# Altium project novena_evt1.PrjPcb (part 3 of 4)

## Sheet 12mPCIe.SchDoc
size B
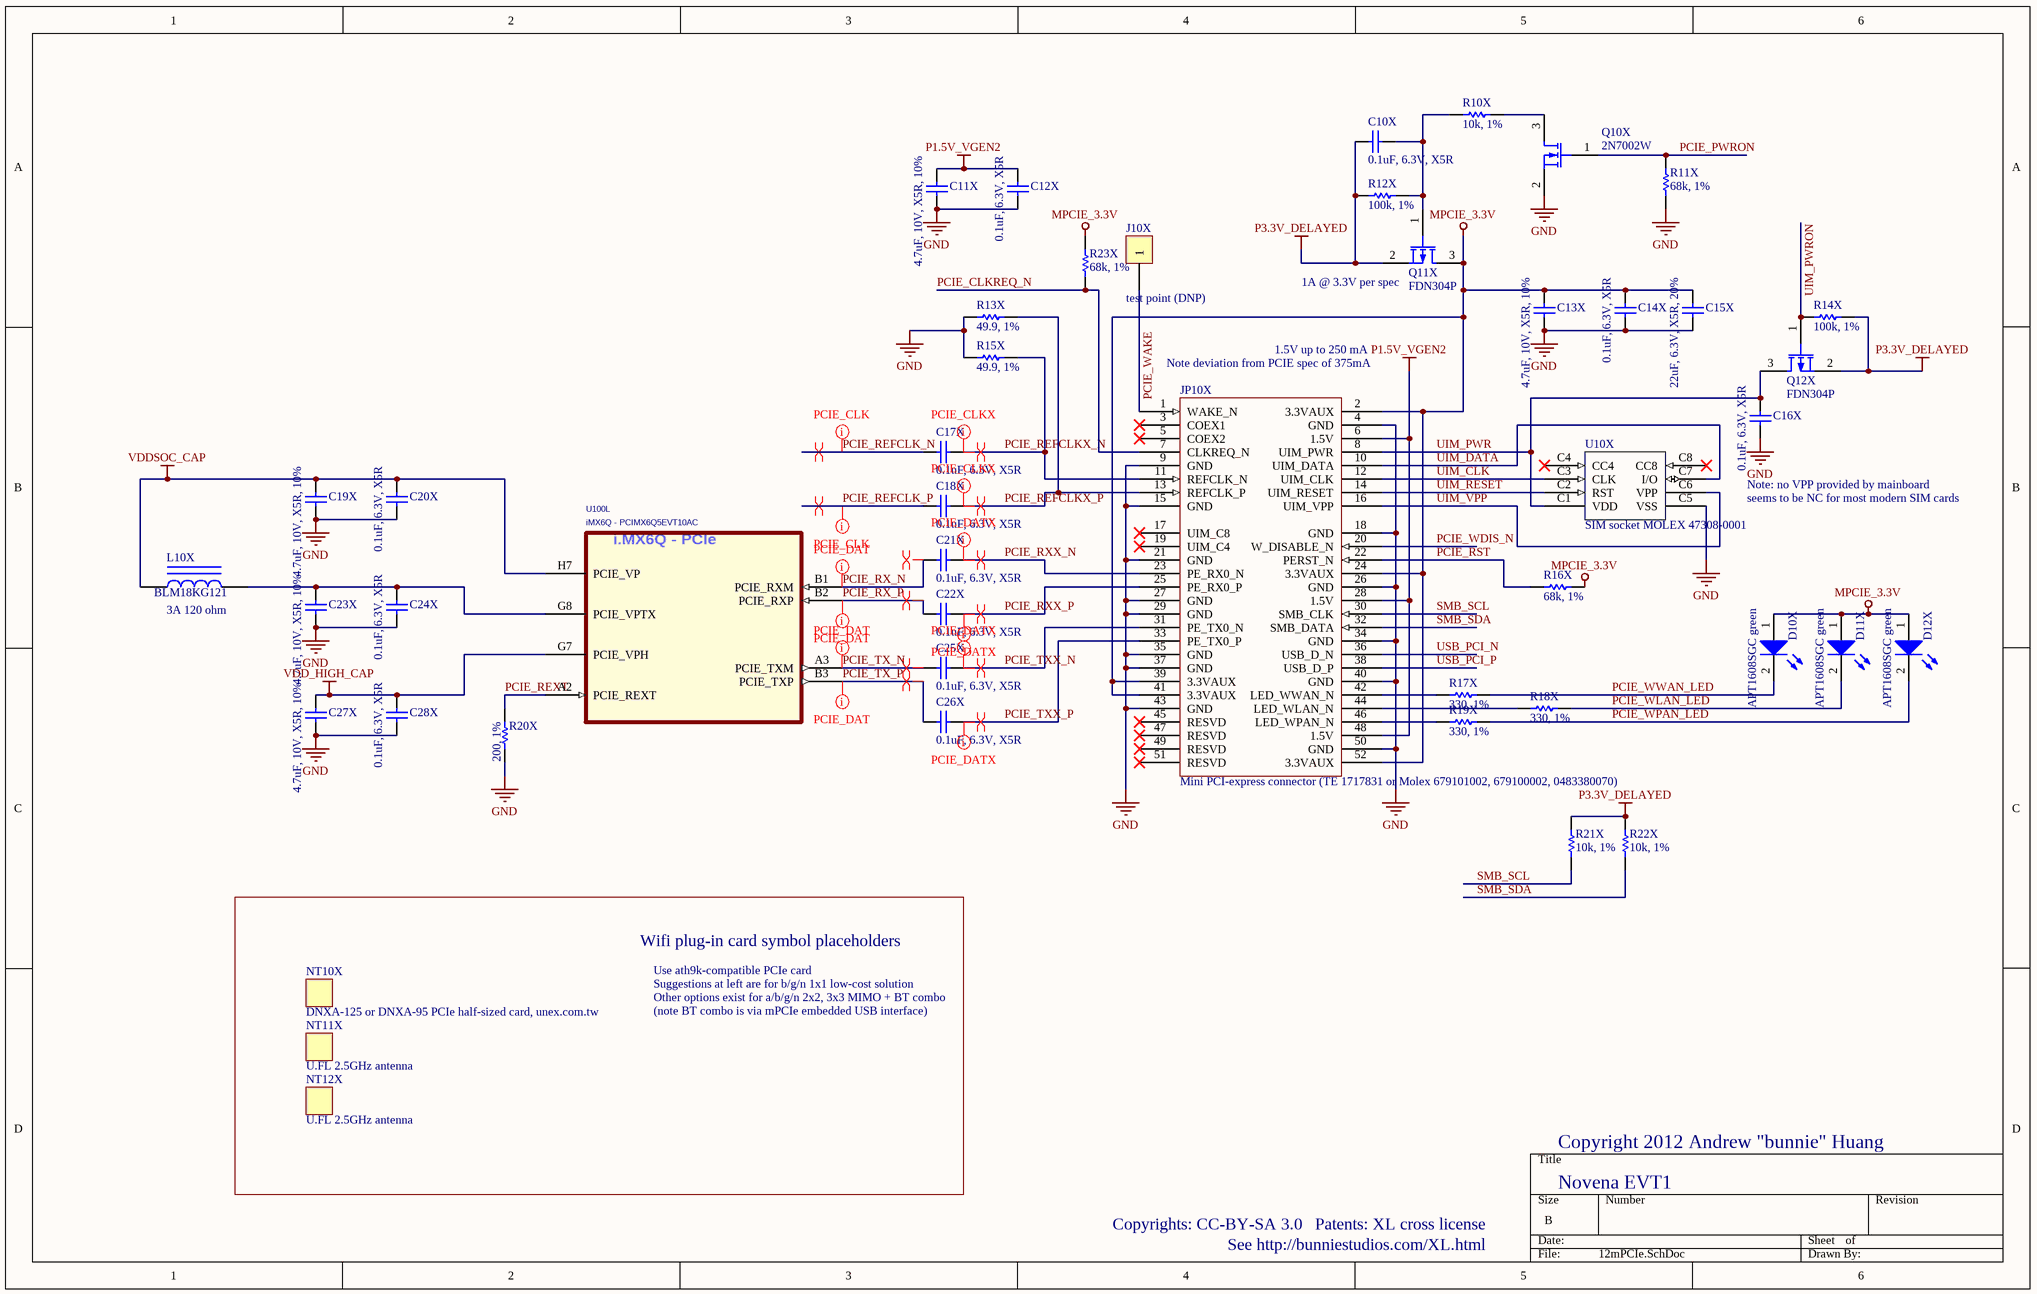
[diagram p12: 12mPCIe.SchDoc]

### Parts
C10X  0.1uF, 6.3V, X5R  [CAPC0603N_B]
C11X  4.7uF, 10V, X5R, 10%  [CAPC1608N]
C12X  0.1uF, 6.3V, X5R  [CAPC0603N_B]
C13X  4.7uF, 10V, X5R, 10%  [CAPC1608N]
C14X  0.1uF, 6.3V, X5R  [CAPC0603N_B]
C15X  22uF, 6.3V, X5R, 20%  [CAPC1608N_HD]
C16X  0.1uF, 6.3V, X5R  [CAPC0603N_B]
C17X  0.1uF, 6.3V, X5R  [CAPC0603N_B]
C18X  0.1uF, 6.3V, X5R  [CAPC0603N_B]
C19X  4.7uF, 10V, X5R, 10%  [CAPC1608N_HD]
C20X  0.1uF, 6.3V, X5R  [CAPC0603N_B]
C21X  0.1uF, 6.3V, X5R  [CAPC0603N_B]
C22X  0.1uF, 6.3V, X5R  [CAPC0603N_B]
C23X  4.7uF, 10V, X5R, 10%  [CAPC1608N_HD]
C24X  0.1uF, 6.3V, X5R  [CAPC0603N_B]
C25X  0.1uF, 6.3V, X5R  [CAPC0603N_B]
C26X  0.1uF, 6.3V, X5R  [CAPC0603N_B]
C27X  4.7uF, 10V, X5R, 10%  [CAPC1608N_HD]
C28X  0.1uF, 6.3V, X5R  [CAPC0603N_B]
D10X  APT1608SGC green  [CD1608-0603]
D11X  APT1608SGC green  [CD1608-0603]
D12X  APT1608SGC green  [CD1608-0603]
J10X  test point (DNP)  [TP_SMT_38mil]
JP10X  Mini PCI-express connector (TE 1717831 or Molex 679101002, 679100002, 0483380070)  [MPCI_FULL_TE_1717831]
L10X  BLM18KG121  value 3A 120 ohm  [INDC1608AN]
NT10X  DNXA-125 or DNXA-95 PCIe half-sized card, unex.com.tw
NT11X  U.FL 2.5GHz antenna
NT12X  U.FL 2.5GHz antenna
Q10X  2N7002W  [SOT323-3AN]
Q11X  FDN304P  [SOT23-3N]
Q12X  FDN304P  [SOT23-3N]
R10X  10k, 1%  [RESC1005N]
R11X  68k, 1%  [RESC1005N]
R12X  100k, 1%  [RESC1005N]
R13X  49.9, 1%  [RESC1005N]
R14X  100k, 1%  [RESC1005N]
R15X  49.9, 1%  [RESC1005N]
R16X  68k, 1%  [RESC1005N]
R17X  330, 1%  [RESC1005N]
R18X  330, 1%  [RESC1005N]
R19X  330, 1%  [RESC1005N]
R20X  200, 1%  [RESC1005N]
R21X  10k, 1%  [RESC1005N]
R22X  10k, 1%  [RESC1005N]
R23X  68k, 1%  [RESC1005N]
U10X  SIM socket MOLEX 47308-0001  [MOLEX_SIM_47308-001]
U100  iMX6Q - PCIMX6Q5EVT10AC  [FREESCALE_BGA624C80P25X25_2100X2100X216]  (part L of 12)

### Blocks framed on the sheet
Wifi plug-in card symbol placeholders: NT10X NT11X NT12X

### Nets
GND: C11X.2 C12X.2 C13X.2 C14X.2 C15X.2 C16X.2 C19X.2 C20X.2 C23X.2 C24X.2 C27X.2 C28X.2 JP10X.4(GND) JP10X.9(GND) JP10X.15(GND) JP10X.18(GND) JP10X.21(GND) JP10X.26(GND) JP10X.27(GND) JP10X.29(GND) JP10X.34(GND) JP10X.35(GND) JP10X.37(GND) JP10X.40(GND) JP10X.43(GND) JP10X.50(GND) Q10X.2(S) R11X.2 R13X.2 R15X.2 R20X.1 U10X.C5(VSS)
MPCIE_3.3V: C13X.1 C14X.1 C15X.1 D10X.1(A) D11X.1(A) D12X.1(A) JP10X.2(3.3VAUX) JP10X.24(3.3VAUX) JP10X.39(3.3VAUX) JP10X.41(3.3VAUX) JP10X.52(3.3VAUX) Q11X.3(D) R16X.1 R23X.2
P1.5V_VGEN2: C11X.1 C12X.1 JP10X.6(1.5V) JP10X.28(1.5V) JP10X.48(1.5V)
P3.3V_DELAYED: C10X.2 Q11X.2(S) Q12X.2(S) R12X.2 R14X.1 R21X.2 R22X.2
VDD_HIGH_CAP: C27X.1 C28X.1 U100.G7(PCIE_VPH)
VDDSOC_CAP: C19X.1 C20X.1 L10X.1 U100.H7(PCIE_VP)
PCIE_CLKREQ_N: JP10X.7(CLKREQ_N) R23X.1
PCIE_PWRON: Q10X.1(G) R11X.1
PCIE_REFCLK_N: C17X.2
PCIE_REFCLK_P: C18X.2
PCIE_REFCLKX_N: C17X.1 JP10X.11(REFCLK_N) R15X.1
PCIE_REFCLKX_P: C18X.1 JP10X.13(REFCLK_P) R13X.1
PCIE_REXT: R20X.2 U100.A2(PCIE_REXT)
PCIE_RST: JP10X.22(PERST_N) R16X.2
PCIE_RX_N: C21X.2 U100.B1(PCIE_RXM)
PCIE_RX_P: C22X.2 U100.B2(PCIE_RXP)
PCIE_RXX_N: C21X.1 JP10X.23(PE_RX0_N)
PCIE_RXX_P: C22X.1 JP10X.25(PE_RX0_P)
PCIE_TX_N: C25X.2 U100.A3(PCIE_TXM)
PCIE_TX_P: C26X.2 U100.B3(PCIE_TXP)
PCIE_TXX_N: C25X.1 JP10X.31(PE_TX0_N)
PCIE_TXX_P: C26X.1 JP10X.33(PE_TX0_P)
PCIE_WAKE: J10X.1 JP10X.1(WAKE_N)
PCIE_WDIS_N: JP10X.20(W_DISABLE_N)
PCIE_WLAN_LED: D11X.2(K) R18X.2
PCIE_WPAN_LED: D12X.2(K) R19X.2
PCIE_WWAN_LED: D10X.2(K) R17X.2
SMB_SCL: JP10X.30(SMB_CLK) R21X.1
SMB_SDA: JP10X.32(SMB_DATA) R22X.1
UIM_CLK: JP10X.12(UIM_CLK) U10X.C3(CLK)
UIM_DATA: JP10X.10(UIM_DATA) U10X.C7(I/O)
UIM_PWR: C16X.1 JP10X.8(UIM_PWR) Q12X.3(D) U10X.C1(VDD)
UIM_PWRON: Q12X.1(G) R14X.2
UIM_RESET: JP10X.14(UIM_RESET) U10X.C2(RST)
UIM_VPP: JP10X.16(UIM_VPP) U10X.C6(VPP)
USB_PCI_N: JP10X.36(USB_D_N)
USB_PCI_P: JP10X.38(USB_D_P)
NetC10X_1: C10X.1 Q11X.1(G) R10X.1 R12X.1
NetC23X_1: C23X.1 C24X.1 L10X.2 U100.G8(PCIE_VPTX)
NetJP10X_42: JP10X.42(LED_WWAN_N) R17X.1
NetJP10X_44: JP10X.44(LED_WLAN_N) R18X.1
NetJP10X_46: JP10X.46(LED_WPAN_N) R19X.1
NetQ10X_3: Q10X.3(D) R10X.2

Not connected (* = marked no-connect by the designer): JP10X 3(COEX1)* 5(COEX2)* 17(UIM_C8)* 19(UIM_C4)* 45(RESVD)* 47(RESVD)* 49(RESVD)* 51(RESVD)*; U10X C4(CC4)* C8(CC8)*

### Layout directives
differential pair: PCIE_REFCLK_N, PCIE_REFCLK_P, PCIE_REFCLKX_N, PCIE_REFCLKX_P, PCIE_RX_N, PCIE_RX_P, PCIE_RXX_N, PCIE_RXX_P, PCIE_TX_N, PCIE_TX_P, PCIE_TXX_N, PCIE_TXX_P
net class PCIE_CLK: PCIE_REFCLK_N, PCIE_REFCLK_P
net class PCIE_DAT: PCIE_RX_N, PCIE_RX_P, PCIE_TX_N, PCIE_TX_P
net class PCIE_DATX: PCIE_RXX_N, PCIE_RXX_P, PCIE_TXX_N, PCIE_TXX_P
net class PCIE_CLKX: PCIE_REFCLKX_N, PCIE_REFCLKX_P

### Notes on the sheet
- (near Q11X) 1A @ 3.3V per spec
- (near JP10X) Note deviation from PCIE spec of 375mA
- 1.5V up to 250 mA
- Note: no VPP provided by mainboard
- seems to be NC for most modern SIM cards
- Use ath9k-compatible PCIe card
- Suggestions at left are for b/g/n 1x1 low-cost solution
- Other options exist for a/b/g/n 2x2, 3x3 MIMO + BT combo
- (note BT combo is via mPCIe embedded USB interface)
- Copyright 2012 Andrew "bunnie" Huang
- Copyrights: CC-BY-SA 3.0
- Patents: XL cross license
- Novena EVT1
- See http://bunniestudios.com/XL.html
- (in symbol PCIMX6Q6VV1A, part L) i.MX6Q - PCIe

### Library data of the parts
C10X C11X C12X C13X C14X C15X C16X C17X C18X C19X C20X C21X C22X C23X C24X C25X C26X C27X C28X = Cap Semi: Capacitor (Semiconductor SIM Model); Published: 8-Jun-2000; LatestRevisionDate: 17-Jul-2002; LatestRevisionNote: Re-released for DXP Platform.; PackageReference: C1206; Publisher: Altium Limited
D10X D11X D12X = LED2: Typical RED, GREEN, YELLOW, AMBER GaAs LED; Published: 8-Jun-2000; LatestRevisionDate: 17-Jul-2002; LatestRevisionNote: Re-released for DXP Platform.; PackageVersion: Feb-2002; PackageReference: 3.2X1.6X1.1; Publisher: Altium Limited
J10X = CON1: Connector
JP10X = MINI_PCIE: Mini PCI-express, e.g. TE 1717831
L10X = Inductor Iron: Magnetic-Core Inductor; Published: 24-Mar-1999; LatestRevisionDate: 17-Jul-2002; LatestRevisionNote: Re-released for DXP Platform.; PackageReference: AXIAL-0.9; Publisher: Altium Limited
NT10X NT11X NT12X = NOTE: Placeholder for non-electrical BOM items
Q10X = MOSFET-N: N-Channel MOSFET; Published: 8-Jun-2000; LatestRevisionDate: 17-Jul-2002; LatestRevisionNote: Re-released for DXP Platform.; PackageVersion: 1995/1996; PackageReference: E3; Publisher: Altium Limited
Q11X Q12X = MOSFET-P: P-Channel MOSFET; Published: 8-Jun-2000; LatestRevisionDate: 17-Jul-2002; LatestRevisionNote: Re-released for DXP Platform.; PackageVersion: 1995/1996; PackageReference: E3; Publisher: Altium Limited; PackageDescription: TO, Flat Index; 3 In-Line, Axial Leads; Body Dia. 4.6mm; Lead Dia. 0.5 mm (max)
R10X R11X R13X R15X R16X R17X R18X R19X R20X R21X R22X R23X = Res1: Resistor; Value: 100k; Published: 8-Jun-2000; LatestRevisionDate: 17-Jul-2002; LatestRevisionNote: Re-released for DXP Platform.; PackageReference: AXIAL-0.3; Publisher: Altium Limited
R12X R14X = Res1: Resistor; Published: 8-Jun-2000; LatestRevisionDate: 17-Jul-2002; LatestRevisionNote: Re-released for DXP Platform.; PackageReference: AXIAL-0.3; Publisher: Altium Limited; Value: 100k
U10X = ISO7816 (SIM card): ISO 7816 SIM card socket
U100 = PCIMX6Q6VV1A: as U100 on sheet 06cpu_soc; MFG_PN01: PCIMX6Q6VV1A; ROHS: Yes; HEIGHT: 2.16MM

## Sheet 13hdmi_lcd.SchDoc
size C
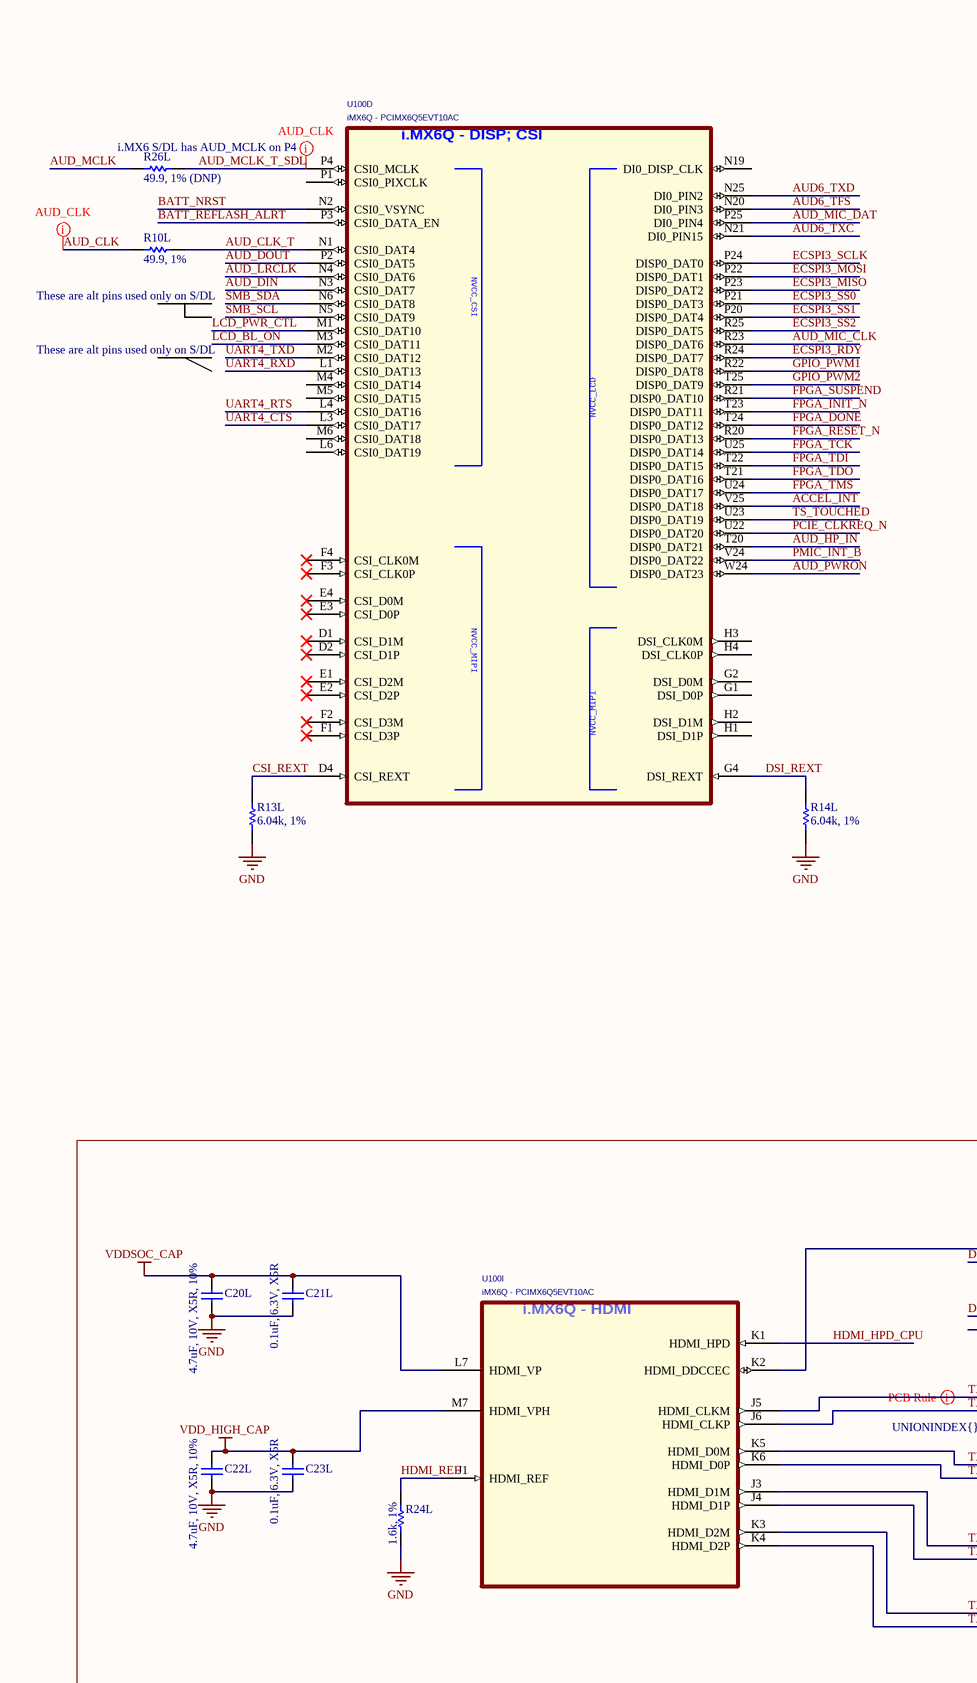
[diagram p13: 13hdmi_lcd.SchDoc, left]
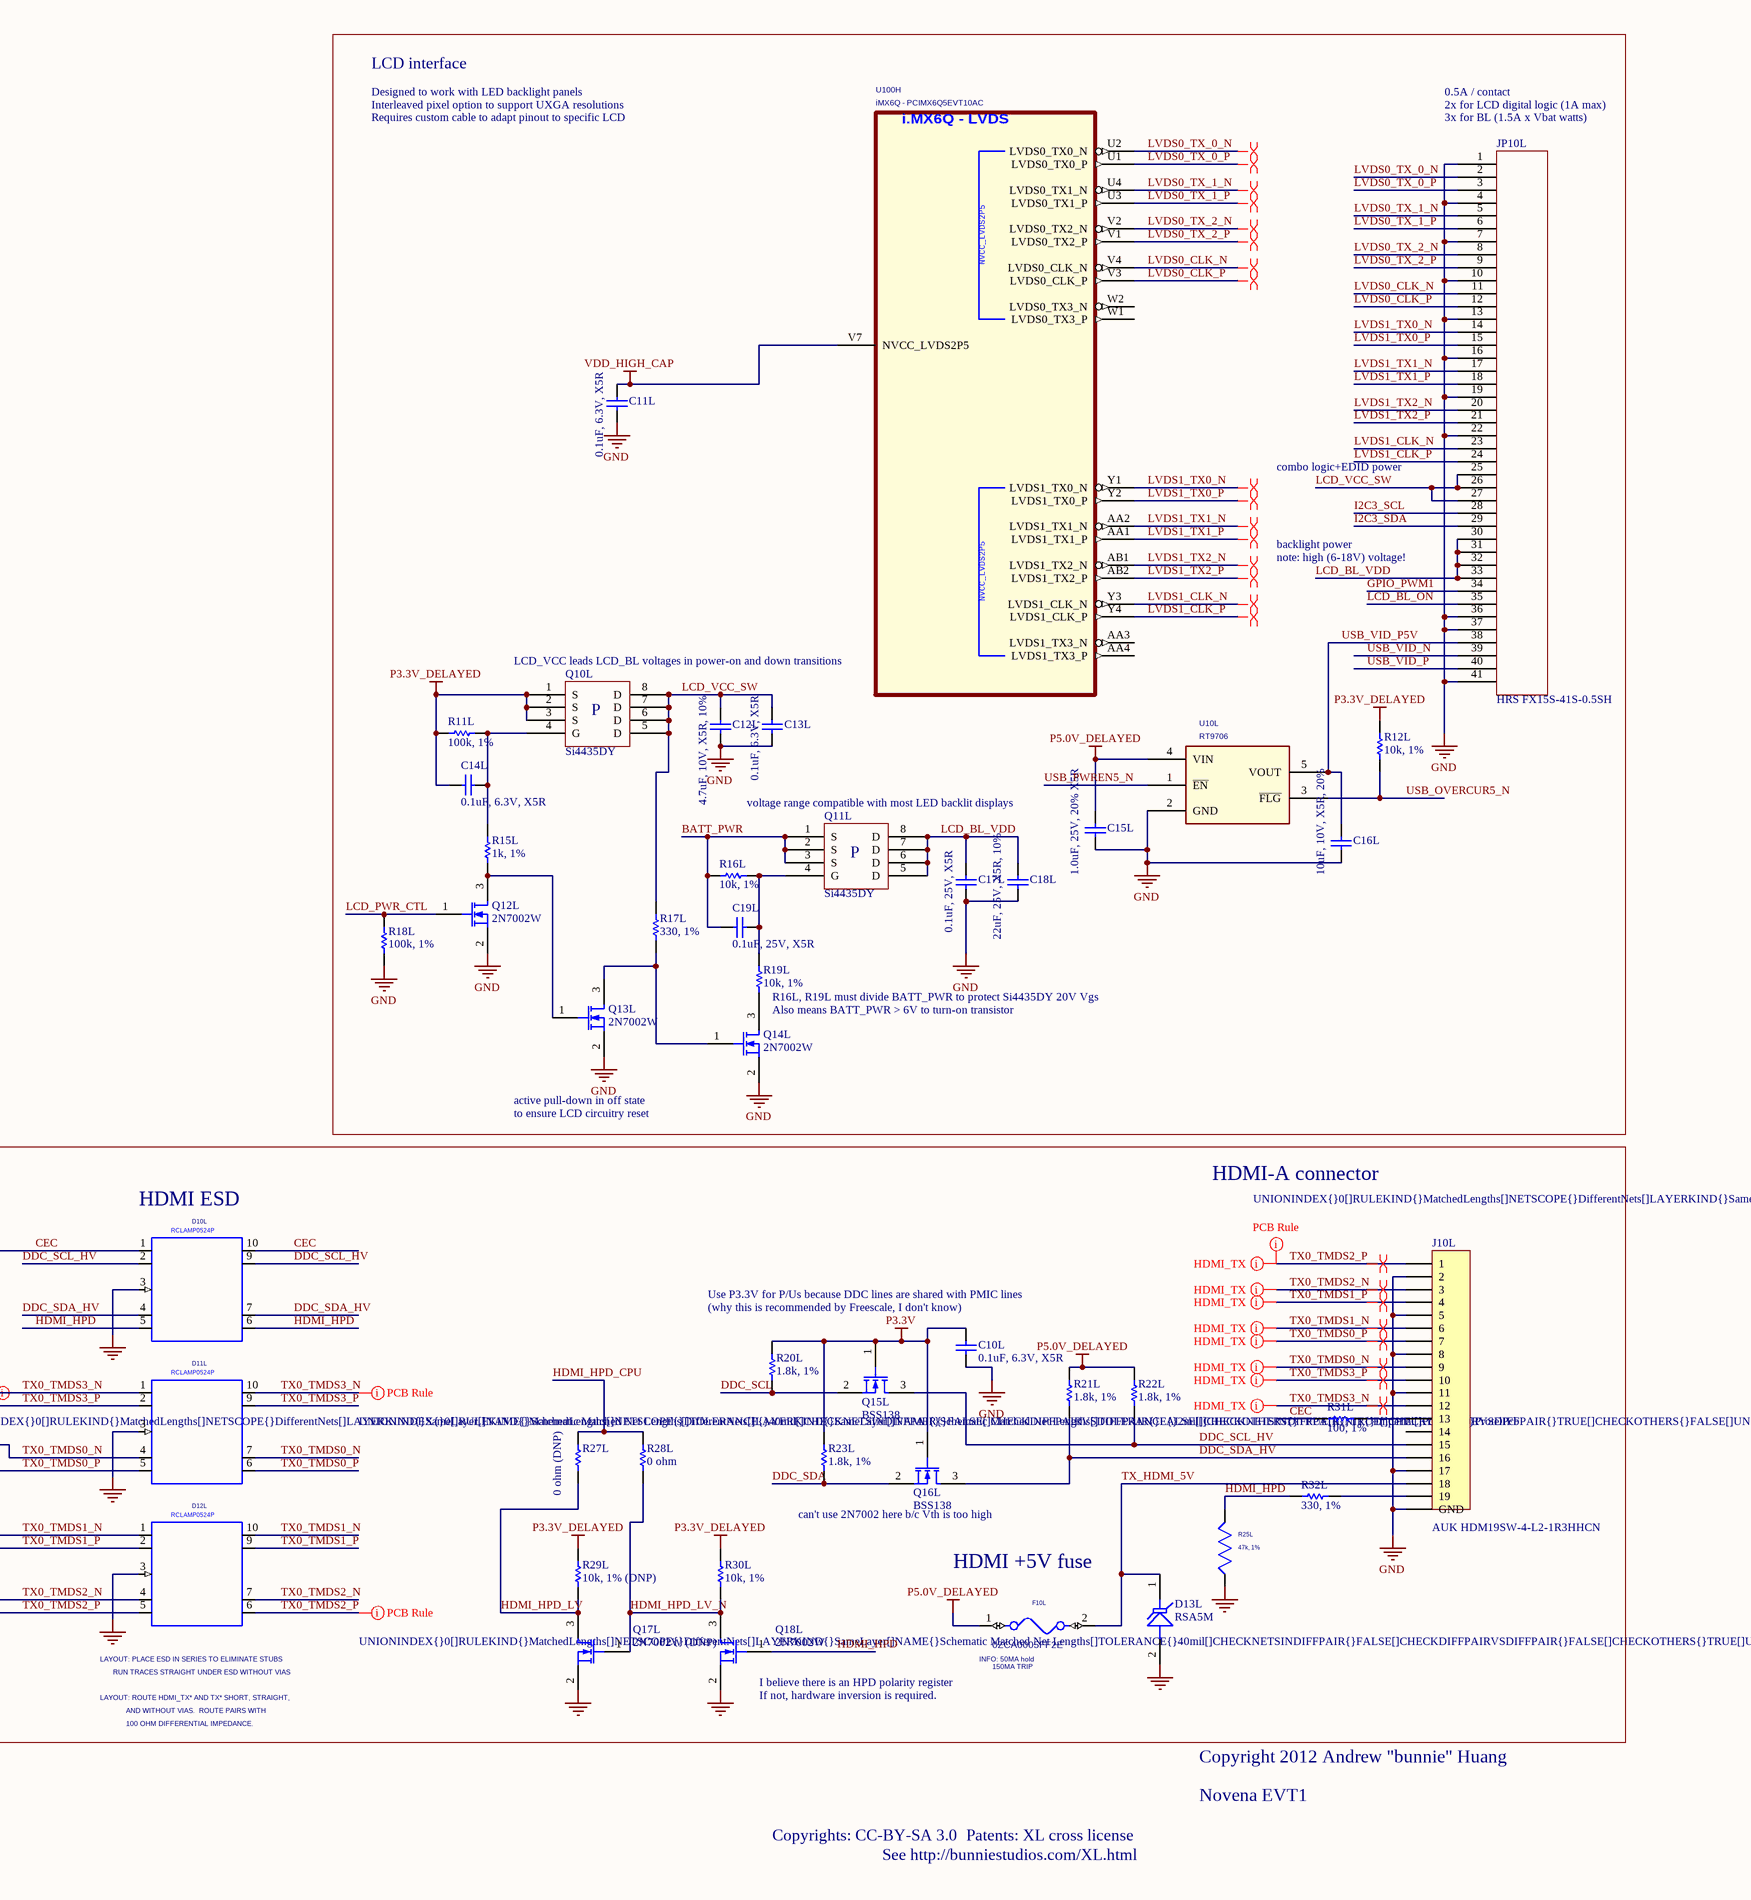
[diagram p14: 13hdmi_lcd.SchDoc, right]

### Parts
C10L  0.1uF, 6.3V, X5R  [CAPC0603N_B]
C11L  0.1uF, 6.3V, X5R  [CAPC0603N_B]
C12L  4.7uF, 10V, X5R, 10%  [CAPC1608N]
C13L  0.1uF, 6.3V, X5R  [CAPC0603N_B]
C14L  0.1uF, 6.3V, X5R  [CAPC0603N_B]
C15L  1.0uF, 25V, 20% X5R  [CAPC1608N]
C16L  10uF, 10V, X5R, 20%  [CAPC1608N]
C17L  0.1uF, 25V, X5R  [CAPC1005N]
C18L  22uF, 25V, X5R, 10%  [CAPC3225N]
C19L  0.1uF, 25V, X5R  [CAPC1005N]
C20L  4.7uF, 10V, X5R, 10%  [CAPC1608N_HD]
C21L  0.1uF, 6.3V, X5R  [CAPC0603N_B]
C22L  4.7uF, 10V, X5R, 10%  [CAPC1608N_HD]
C23L  0.1uF, 6.3V, X5R  [CAPC0603N_B]
D10L  RCLAMP0524P  [SEMTECH_SLP2510P8]  (value not drawn)
D11L  RCLAMP0524P  [SEMTECH_SLP2510P8]  (value not drawn)
D12L  RCLAMP0524P  [SEMTECH_SLP2510P8]  (value not drawn)
D13L  RSA5M  [SOD123/X.85]
F10L  0ZCA0005FF2E  [RESC3216N]
J10L  AUK HDM19SW-4-L2-1R3HHCN  [MOLEX_47151-0001]
JP10L  HRS FX15S-41S-0.5SH  [HRS_FX15S-41S-0.5SH]
Q10L  Si4435DY  [SOIC127P600-8AN]
Q11L  Si4435DY  [SOIC127P600-8AN]
Q12L  2N7002W  [SOT323-3AN]
Q13L  2N7002W  [SOT323-3AN]
Q14L  2N7002W  [SOT323-3AN]
Q15L  BSS138  [SOT23-3N]
Q16L  BSS138  [SOT23-3N]
Q17L  2N7002W (DNP)  [SOT323-3AN]
Q18L  2N7002W  [SOT323-3AN]
R10L  49.9, 1%  [RESC1005N]
R11L  100k, 1%  [RESC1005N]
R12L  10k, 1%  [RESC1005N]
R13L  6.04k, 1%  [RESC1005N]
R14L  6.04k, 1%  [RESC1005N]
R15L  1k, 1%  [RESC1005N]
R16L  10k, 1%  [RESC1005N]
R17L  330, 1%  [RESC1005N]
R18L  100k, 1%  [RESC1005N]
R19L  10k, 1%  [RESC1005N]
R20L  1.8k, 1%  [RESC1005N]
R21L  1.8k, 1%  [RESC1005N]
R22L  1.8k, 1%  [RESC1005N]
R23L  1.8k, 1%  [RESC1005N]
R24L  1.6k, 1%  [RESC1005N]
R25L  47k, 1%  [RESC1005N]
R26L  49.9, 1% (DNP)  [RESC1005N]
R27L  0 ohm (DNP)  [RESC1005N]
R28L  0 ohm  [RESC1005N]
R29L  10k, 1% (DNP)  [RESC1005N]
R30L  10k, 1%  [RESC1005N]
R31L  100, 1%  [RESC1005N]
R32L  330, 1%  [RESC1005N]
U10L  RT9706  [SOT23-5AN]
U100  iMX6Q - PCIMX6Q5EVT10AC  [FREESCALE_BGA624C80P25X25_2100X2100X216]  (parts D,H,I of 12)

### Blocks framed on the sheet
LCD interface: C11L C12L C13L C14L C15L C16L C17L C18L C19L JP10L Q10L Q11L Q12L Q13L Q14L R11L R12L R15L R16L R17L R18L R19L U10L U100

### Nets
GND: C10L.2 C11L.2 C12L.2 C13L.2 C15L.2 C16L.2 C17L.2 C18L.2 C20L.2 C21L.2 C22L.2 C23L.2 D10L.3(GND1) D11L.3(GND1) D12L.3(GND1) D13L.2(A) J10L.0(GND) J10L.2 J10L.5 J10L.8 J10L.11 J10L.17 JP10L.1 JP10L.4 JP10L.7 JP10L.10 JP10L.13 JP10L.16 JP10L.19 JP10L.22 JP10L.36 JP10L.37 JP10L.41 Q12L.2(S) Q13L.2(S) Q14L.2(S) Q17L.2(S) Q18L.2(S) R13L.2 R14L.2 R18L.1 R24L.1 R25L.2(B) U10L.2(GND)
P3.3V: C10L.1 Q15L.1(G) Q16L.1(G) R20L.1 R23L.1
P3.3V_DELAYED: C14L.1 Q10L.1(S) Q10L.2(S) Q10L.3(S) R11L.2 R12L.2 R29L.1 R30L.1
P5.0V_DELAYED: C15L.1 F10L.1 R21L.1 R22L.1 U10L.4(VIN)
VDD_HIGH_CAP: C11L.1 C22L.1 C23L.1 U100.M7(HDMI_VPH) U100.V7(NVCC_LVDS2P5)
VDDSOC_CAP: C20L.1 C21L.1 U100.L7(HDMI_VP)
ACCEL_INT: U100.V25(DISP0_DAT18)
AUD6_TFS: U100.N20(DI0_PIN3)
AUD6_TXC: U100.N21(DI0_PIN15)
AUD6_TXD: U100.N25(DI0_PIN2)
AUD_CLK: R10L.2
AUD_CLK_T: R10L.1 U100.N1(CSI0_DAT4)
AUD_DIN: U100.N3(CSI0_DAT7)
AUD_DOUT: U100.P2(CSI0_DAT5)
AUD_HP_IN: U100.T20(DISP0_DAT21)
AUD_LRCLK: U100.N4(CSI0_DAT6)
AUD_MCLK: R26L.2
AUD_MCLK_T_SDL: R26L.1 U100.P4(CSI0_MCLK)
AUD_MIC_CLK: U100.R23(DISP0_DAT6)
AUD_MIC_DAT: U100.P25(DI0_PIN4)
AUD_PWRON: U100.W24(DISP0_DAT23)
BATT_NRST: U100.N2(CSI0_VSYNC)
BATT_PWR: C19L.1 Q11L.1(S) Q11L.2(S) Q11L.3(S) R16L.2
BATT_REFLASH_ALRT: U100.P3(CSI0_DATA_EN)
CEC: D10L.1(IO1A) D10L.10(IO1B) R31L.2 U100.K2(HDMI_DDCCEC)
CSI_REXT: R13L.1 U100.D4(CSI_REXT)
DDC_SCL: Q15L.2(S) R20L.2
DDC_SCL_HV: D10L.2(IO2A) D10L.9(IO2B) J10L.15 Q15L.3(D) R22L.2
DDC_SDA: Q16L.2(S) R23L.2
DDC_SDA_HV: D10L.4(IO3A) D10L.7(IO3B) J10L.16 Q16L.3(D) R21L.2
DSI_REXT: R14L.1 U100.G4(DSI_REXT)
ECSPI3_MISO: U100.P23(DISP0_DAT2)
ECSPI3_MOSI: U100.P22(DISP0_DAT1)
ECSPI3_RDY: U100.R24(DISP0_DAT7)
ECSPI3_SCLK: U100.P24(DISP0_DAT0)
ECSPI3_SS0: U100.P21(DISP0_DAT3)
ECSPI3_SS1: U100.P20(DISP0_DAT4)
ECSPI3_SS2: U100.R25(DISP0_DAT5)
FPGA_DONE: U100.T24(DISP0_DAT12)
FPGA_INIT_N: U100.T23(DISP0_DAT11)
FPGA_RESET_N: U100.R20(DISP0_DAT13)
FPGA_SUSPEND: U100.R21(DISP0_DAT10)
FPGA_TCK: U100.U25(DISP0_DAT14)
FPGA_TDI: U100.T22(DISP0_DAT15)
FPGA_TDO: U100.T21(DISP0_DAT16)
FPGA_TMS: U100.U24(DISP0_DAT17)
GPIO_PWM1: JP10L.34 U100.R22(DISP0_DAT8)
GPIO_PWM2: U100.T25(DISP0_DAT9)
HDMI_HPD: D10L.5(IO4A) D10L.6(IO4B) Q18L.1(G) R25L.1(A) R32L.2
HDMI_HPD_CPU: R27L.1 R28L.1 U100.K1(HDMI_HPD)
HDMI_HPD_LV: Q17L.3(D) R27L.2 R29L.2
HDMI_HPD_LV_N: Q17L.1(G) Q18L.3(D) R28L.2 R30L.2
HDMI_REF: R24L.2 U100.J1(HDMI_REF)
I2C3_SCL: JP10L.28
I2C3_SDA: JP10L.29
LCD_BL_ON: JP10L.35 U100.M3(CSI0_DAT11)
LCD_BL_VDD: C17L.1 C18L.1 JP10L.30 JP10L.31 JP10L.32 JP10L.33 Q11L.5(D) Q11L.6(D) Q11L.7(D) Q11L.8(D)
LCD_PWR_CTL: Q12L.1(G) R18L.2 U100.M1(CSI0_DAT10)
LCD_VCC_SW: C12L.1 C13L.1 JP10L.25 JP10L.26 JP10L.27 Q10L.5(D) Q10L.6(D) Q10L.7(D) Q10L.8(D) R17L.2
LVDS0_CLK_N: JP10L.11 U100.V4(LVDS0_CLK_N)
LVDS0_CLK_P: JP10L.12 U100.V3(LVDS0_CLK_P)
LVDS0_TX_0_N: JP10L.2 U100.U2(LVDS0_TX0_N)
LVDS0_TX_0_P: JP10L.3 U100.U1(LVDS0_TX0_P)
LVDS0_TX_1_N: JP10L.5 U100.U4(LVDS0_TX1_N)
LVDS0_TX_1_P: JP10L.6 U100.U3(LVDS0_TX1_P)
LVDS0_TX_2_N: JP10L.8 U100.V2(LVDS0_TX2_N)
LVDS0_TX_2_P: JP10L.9 U100.V1(LVDS0_TX2_P)
LVDS1_CLK_N: JP10L.23 U100.Y3(LVDS1_CLK_N)
LVDS1_CLK_P: JP10L.24 U100.Y4(LVDS1_CLK_P)
LVDS1_TX0_N: JP10L.14 U100.Y1(LVDS1_TX0_N)
LVDS1_TX0_P: JP10L.15 U100.Y2(LVDS1_TX0_P)
LVDS1_TX1_N: JP10L.17 U100.AA2(LVDS1_TX1_N)
LVDS1_TX1_P: JP10L.18 U100.AA1(LVDS1_TX1_P)
LVDS1_TX2_N: JP10L.20 U100.AB1(LVDS1_TX2_N)
LVDS1_TX2_P: JP10L.21 U100.AB2(LVDS1_TX2_P)
PCIE_CLKREQ_N: U100.U22(DISP0_DAT20)
PMIC_INT_B: U100.V24(DISP0_DAT22)
SMB_SCL: U100.N5(CSI0_DAT9)
SMB_SDA: U100.N6(CSI0_DAT8)
TS_TOUCHED: U100.U23(DISP0_DAT19)
TX0_TMDS0_N: D11L.4(IO3A) D11L.7(IO3B) J10L.9 U100.K5(HDMI_D0M)
TX0_TMDS0_P: D11L.5(IO4A) D11L.6(IO4B) J10L.7 U100.K6(HDMI_D0P)
TX0_TMDS1_N: D12L.1(IO1A) D12L.10(IO1B) J10L.6 U100.J3(HDMI_D1M)
TX0_TMDS1_P: D12L.2(IO2A) D12L.9(IO2B) J10L.4 U100.J4(HDMI_D1P)
TX0_TMDS2_N: D12L.4(IO3A) D12L.7(IO3B) J10L.3 U100.K3(HDMI_D2M)
TX0_TMDS2_P: D12L.5(IO4A) D12L.6(IO4B) J10L.1 U100.K4(HDMI_D2P)
TX0_TMDS3_N: D11L.1(IO1A) D11L.10(IO1B) J10L.12 U100.J5(HDMI_CLKM)
TX0_TMDS3_P: D11L.2(IO2A) D11L.9(IO2B) J10L.10 U100.J6(HDMI_CLKP)
TX_HDMI_5V: D13L.1(K) F10L.2 J10L.18
UART4_CTS: U100.L3(CSI0_DAT17)
UART4_RTS: U100.L4(CSI0_DAT16)
UART4_RXD: U100.L1(CSI0_DAT13)
UART4_TXD: U100.M2(CSI0_DAT12)
USB_OVERCUR5_N: R12L.1 U10L.3(~{FLG})
USB_PWREN5_N: U10L.1(~{EN})
USB_VID_N: JP10L.39
USB_VID_P: JP10L.40
USB_VID_P5V: C16L.1 JP10L.38 U10L.5(VOUT)
NetC14L_2: C14L.2 Q10L.4(G) R11L.1 R15L.1
NetC19L_2: C19L.2 Q11L.4(G) R16L.1 R19L.1
NetJ10L_13: J10L.13 R31L.1
NetJ10L_19: J10L.19 R32L.1
NetQ12L_3: Q12L.3(D) Q13L.1(G) R15L.2
NetQ13L_3: Q13L.3(D) Q14L.1(G) R17L.1
NetQ14L_3: Q14L.3(D) R19L.2

Not connected (* = marked no-connect by the designer): J10L 14; U100 AA3(LVDS1_TX3_N) AA4(LVDS1_TX3_P) D1(CSI_D1M)* D2(CSI_D1P)* E1(CSI_D2M)* E2(CSI_D2P)* E3(CSI_D0P)* E4(CSI_D0M)* F1(CSI_D3P)* F2(CSI_D3M)* F3(CSI_CLK0P)* F4(CSI_CLK0M)* G1(DSI_D0P) G2(DSI_D0M) H1(DSI_D1P) H2(DSI_D1M) H3(DSI_CLK0M) H4(DSI_CLK0P) L6(CSI0_DAT19) M4(CSI0_DAT14) M5(CSI0_DAT15) M6(CSI0_DAT18) N19(DI0_DISP_CLK) P1(CSI0_PIXCLK) W1(LVDS0_TX3_P) W2(LVDS0_TX3_N)

### Layout directives
differential pair: LVDS0_CLK_N, LVDS0_CLK_P, LVDS0_TX_0_N, LVDS0_TX_0_P, LVDS0_TX_1_N, LVDS0_TX_1_P, LVDS0_TX_2_N, LVDS0_TX_2_P, LVDS1_CLK_N, LVDS1_CLK_P, LVDS1_TX0_N, LVDS1_TX0_P, LVDS1_TX1_N, LVDS1_TX1_P, LVDS1_TX2_N, LVDS1_TX2_P, TX0_TMDS0_N, TX0_TMDS0_P, TX0_TMDS1_N, TX0_TMDS1_P, TX0_TMDS2_N, TX0_TMDS2_P, TX0_TMDS3_N, TX0_TMDS3_P
net class HDMI_TX: TX0_TMDS0_N, TX0_TMDS0_P, TX0_TMDS1_N, TX0_TMDS1_P, TX0_TMDS2_N, TX0_TMDS2_P, TX0_TMDS3_N, TX0_TMDS3_P
rule Matched Net Lengths [Tolerance = 40mil]: TX0_TMDS2_P, TX0_TMDS3_N
rule Matched Net Lengths [Tolerance = 2mil]: TX0_TMDS2_P, TX0_TMDS3_N
net class AUD_CLK: AUD_CLK, AUD_MCLK_T_SDL

### Notes on the sheet
- Designed to work with LED backlight panels
- Interleaved pixel option to support UXGA resolutions
- Requires custom cable to adapt pinout to specific LCD
- 0.5A / contact
- 2x for LCD digital logic (1A max)
- (near JP10L) 3x for BL (1.5A x Vbat watts)
- (near R26L) i.MX6 S/DL has AUD_MCLK on P4
- (near R10L) These are alt pins used only on S/DL
- These are alt pins used only on S/DL
- combo logic+EDID power
- backlight power
- note: high (6-18V) voltage!
- (near U100) LCD_VCC leads LCD_BL voltages in power-on and down transitions
- voltage range compatible with most LED backlit displays
- (near R19L) R16L, R19L must divide BATT_PWR to protect Si4435DY 20V Vgs
- Also means BATT_PWR > 6V to turn-on transistor
- active pull-down in off state
- to ensure LCD circuitry reset
- (near D10L) HDMI ESD
- HDMI-A connector
- Use P3.3V for P/Us because DDC lines are shared with PMIC lines
- (why this is recommended by Freescale, I don't know)
- can't use 2N7002 here b/c Vth is too high
- HDMI +5V fuse
- (near D12L) LAYOUT: PLACE ESD IN SERIES TO ELIMINATE STUBS
- RUN TRACES STRAIGHT UNDER ESD WITHOUT VIAS
- (near F10L) INFO: 50MA hold
- (near F10L) 150MA TRIP
- LAYOUT: ROUTE HDMI_TX* AND TX* SHORT, STRAIGHT,
- 100 OHM DIFFERENTIAL IMPEDANCE.
- AND WITHOUT VIAS.  ROUTE PAIRS WITH
- (near Q18L) I believe there is an HPD polarity register
- (near Q18L) If not, hardware inversion is required.
- Copyright 2012 Andrew "bunnie" Huang
- Novena EVT1
- Copyrights: CC-BY-SA 3.0
- See http://bunniestudios.com/XL.html
- Patents: XL cross license
- (in symbol PCIMX6Q6VV1A, part D) i.MX6Q - DISP; CSI
- (in symbol PCIMX6Q6VV1A, part H) i.MX6Q - LVDS
- (in symbol PCIMX6Q6VV1A, part I) i.MX6Q - HDMI
- (in symbol Si4435DY) P

### Library data of the parts
C10L C11L C12L C13L C14L C15L C16L C17L C18L C19L C20L C21L C22L C23L = Cap Semi: Capacitor (Semiconductor SIM Model); Published: 8-Jun-2000; LatestRevisionDate: 17-Jul-2002; LatestRevisionNote: Re-released for DXP Platform.; PackageReference: C1206; Publisher: Altium Limited
D10L D11L D12L = RCLAMP0524P: PART_NUMBER: V00004-001; CDS_LMAN_SYM_OUTLINE: -175,225,175,-175; MATERIAL: IC; PACK_TYPE: SLP1610P4; PATH: I24; OriginalSymbolOrigin: (-175,225); LOCATION: D8; XY: (-2475,4175); VER: 1; ROT: 0; PHYS_PAGE: 10; DRAWING: @BROWNSTONE_LIB.BROWNSTONE(SCH_1):PAGE10; CDS_LIB: integrated_circuits; SEC_TYPE: SLP1610P4; SEC: 1; CDS_LOCATION: D8; $LOCATION: D8
D13L = Tranzorb: Published: 24-Mar-1999; LatestRevisionDate: 17-Jul-2002; LatestRevisionNote: Re-released for DXP Platform.; PackageReference: DO-7; Publisher: Altium Limited
F10L = FUSE0805: BelFuse, 50mA hold, 150mA trip; PART_NUMBER: M00014-001; CDS_LMAN_SYM_OUTLINE: -75,50,75,-50; OriginalSymbolOrigin: (-125,50); LOCATION: F1; XY: (-4350,3000); VER: 1; ROT: 0; PHYS_PAGE: 10; PATH: I13; MATERIAL: FUSE; DRAWING: @BROWNSTONE_LIB.BROWNSTONE(SCH_1):PAGE10; CDS_LIB: fuses; SEC_TYPE: FUSE0805; SEC: 1; PACK_TYPE: FUSE0805; CDS_LOCATION: F1; $LOCATION: F1
J10L = Header 19: Molex HDMI connector, Type A; LatestRevisionDate: 17-Jul-2002; LatestRevisionNote: Re-released for DXP Platform.; Publisher: Altium Limited
JP10L = HRS_FX15S-41S-0.5SH: 41-pin header
Q10L Q11L = Si4435DY: Singre P-channel FET, 8A, 30V
Q12L Q13L Q14L Q15L Q16L Q17L Q18L = MOSFET-N: N-Channel MOSFET; Published: 8-Jun-2000; LatestRevisionDate: 17-Jul-2002; LatestRevisionNote: Re-released for DXP Platform.; PackageVersion: 1995/1996; PackageReference: E3; Publisher: Altium Limited
R10L R12L R13L R14L R15L R16L R17L R19L R20L R21L R22L R23L R24L R26L R27L R28L R29L R30L R31L R32L = Res1: Resistor; Value: 100k; Published: 8-Jun-2000; LatestRevisionDate: 17-Jul-2002; LatestRevisionNote: Re-released for DXP Platform.; PackageReference: AXIAL-0.3; Publisher: Altium Limited
R11L R18L = Res1: Resistor; Published: 8-Jun-2000; LatestRevisionDate: 17-Jul-2002; LatestRevisionNote: Re-released for DXP Platform.; PackageReference: AXIAL-0.3; Publisher: Altium Limited; Value: 100k
R25L = RES#1: PART_NUMBER: D13015-001; NEEDS_NO_SIZE: TRUE; PACK_TYPE: RES0402; PATH: I12; WATTAGE: 1/16W; OriginalSymbolOrigin: (-50,100); LOCATION: R125; SEC: 1; XY: (-1400,3050); VER: 2; ROT: 0; PHYS_PAGE: 10; MFG_PN: ERJ-2RKF1002X; MFG: PANASONIC; DRAWING: @BROWNSTONE_LIB.BROWNSTONE(SCH_1):PAGE10; CDS_LIB: resistors; MATERIAL: CH; TOL: 1%; TOLERENCE: ?; CDS_SEC: 1; CDS_LOCATION: R125; $TOLERENCE: ?; $SEC: 1; $LOCATION: R125
U10L = RT9706: IC LIN SW W/FLAG 500MA 2.0-5.5V SOT23-5; AGILE_PN: 315-77830; MFG_NAME01: RICHTEK; MFG_PN01: RT9706PB; CAD_APPROVED: Yes; ROHS: Yes; HEIGHT: 1.295MM
U100 = PCIMX6Q6VV1A: PCIMX6Q5EVT10AC; AGILE_PN: TMP-WF-14526; DESCRIPTION: PLACEHOLDER FOR FREESCALE PART NUMBER PMCIMX6Q6VV1A.; MFG_NAME01: Freescale Semiconductor; PRE_APN: 344-01218; MFG_PN01: PCIMX6Q6VV1A; ROHS: Yes; HEIGHT: 2.16MM

## Sheet 14audio.SchDoc
size B
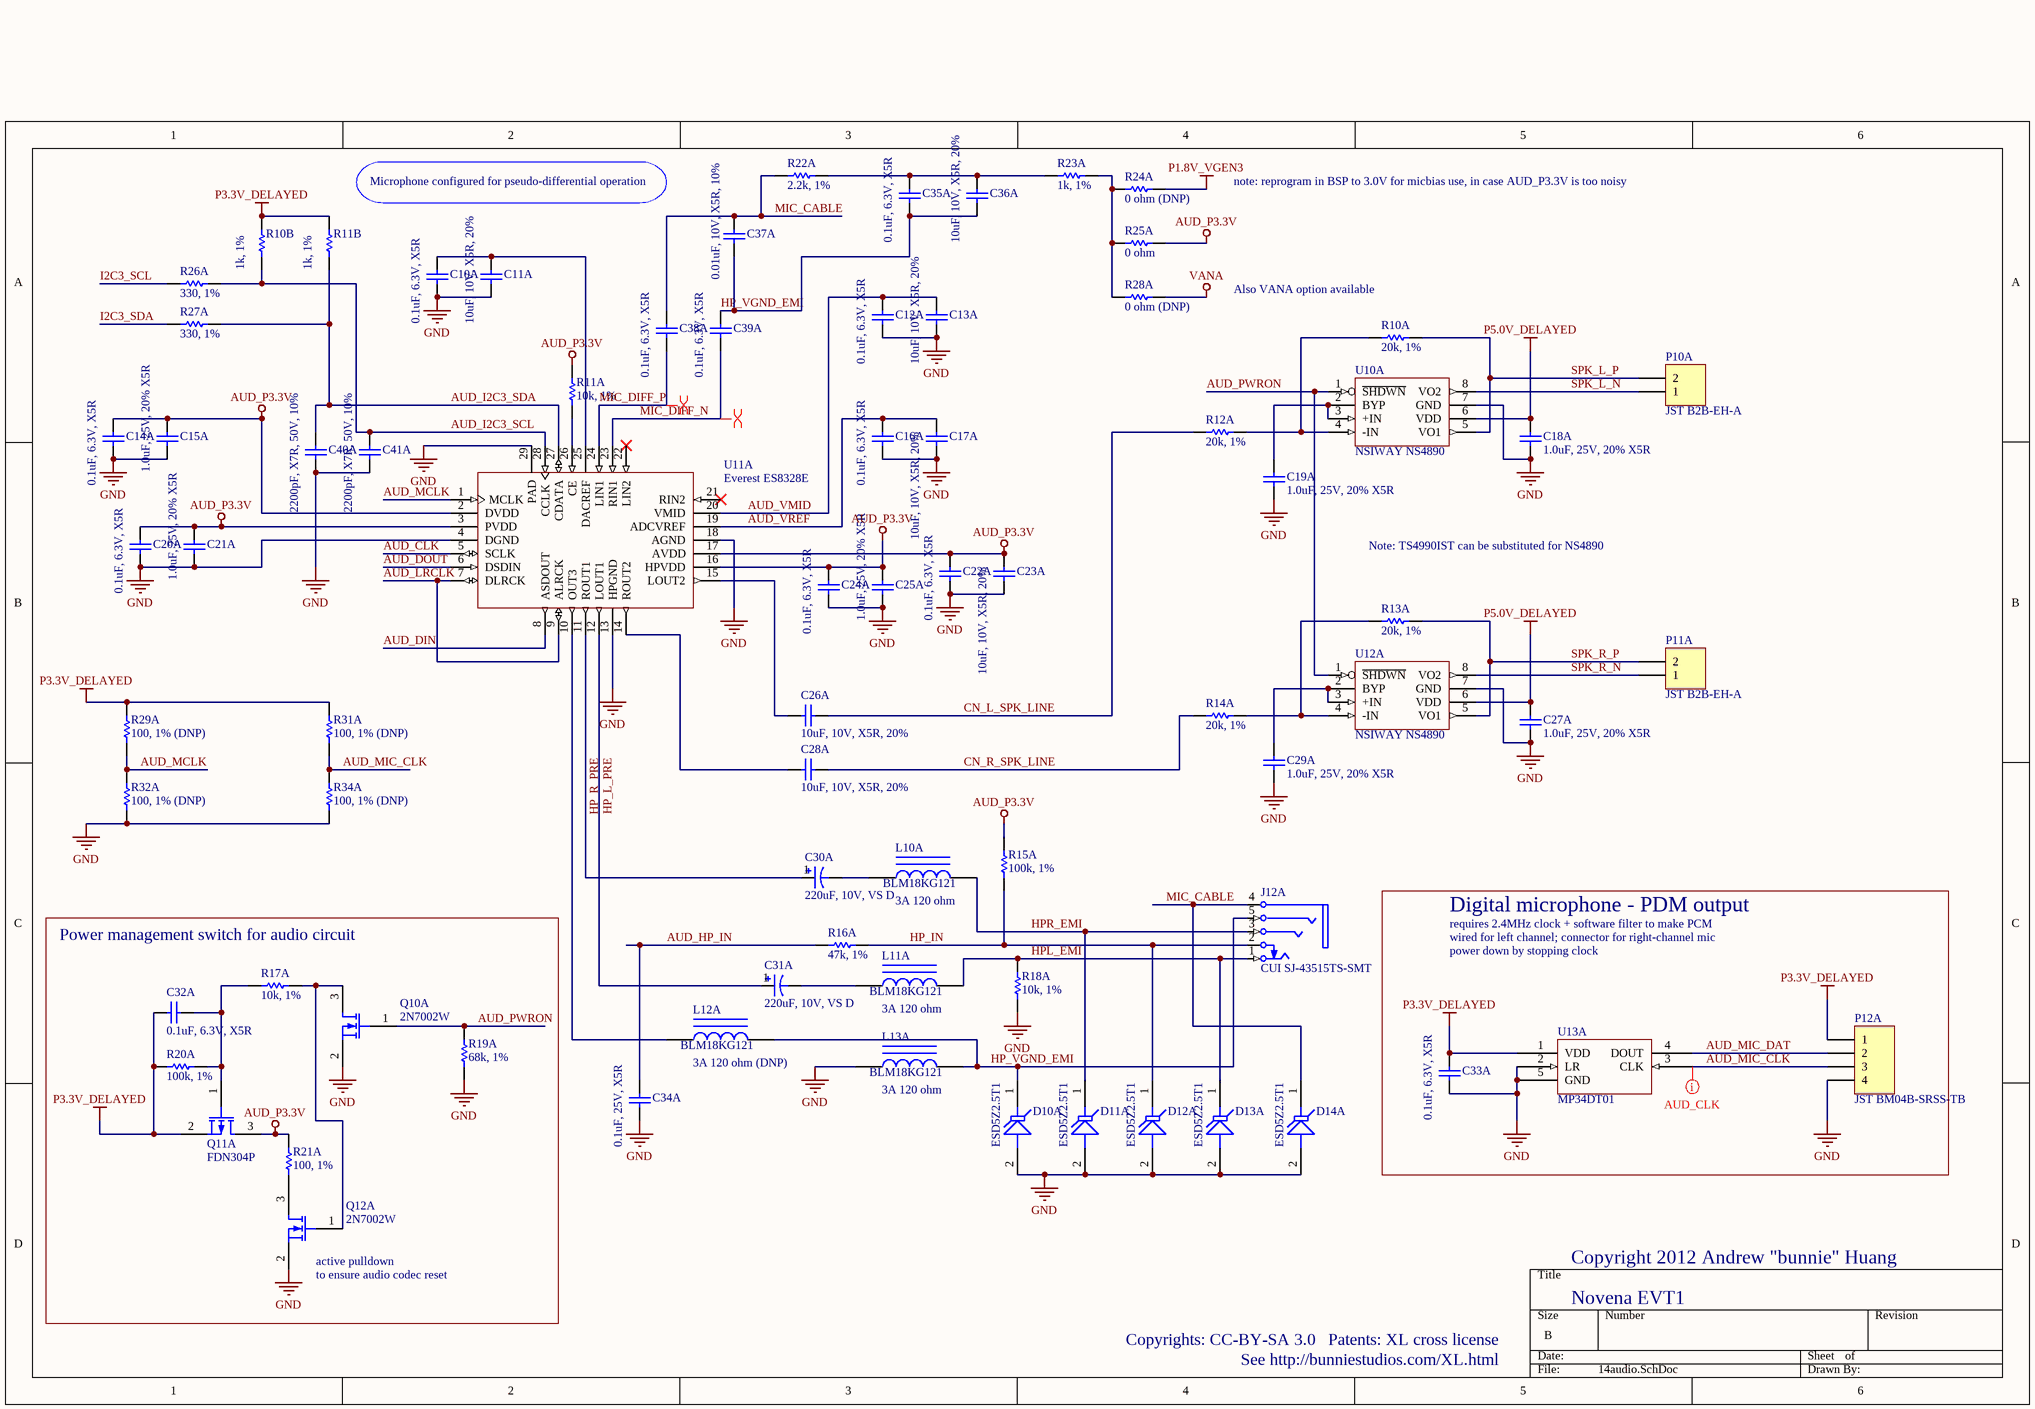
[diagram p15: 14audio.SchDoc]

### Parts
C10A  0.1uF, 6.3V, X5R  [CAPC0603N_B]
C11A  10uF, 10V, X5R, 20%  [CAPC1608N]
C12A  0.1uF, 6.3V, X5R  [CAPC0603N_B]
C13A  10uF, 10V, X5R, 20%  [CAPC1608N]
C14A  0.1uF, 6.3V, X5R  [CAPC0603N_B]
C15A  1.0uF, 25V, 20% X5R  [CAPC1608N]
C16A  0.1uF, 6.3V, X5R  [CAPC0603N_B]
C17A  10uF, 10V, X5R, 20%  [CAPC1608N]
C18A  1.0uF, 25V, 20% X5R  [CAPC1608N]
C19A  1.0uF, 25V, 20% X5R  [CAPC1608N]
C20A  0.1uF, 6.3V, X5R  [CAPC0603N_B]
C21A  1.0uF, 25V, 20% X5R  [CAPC1608N]
C22A  0.1uF, 6.3V, X5R  [CAPC0603N_B]
C23A  10uF, 10V, X5R, 20%  [CAPC1608N]
C24A  0.1uF, 6.3V, X5R  [CAPC0603N_B]
C25A  1.0uF, 25V, 20% X5R  [CAPC1608N]
C26A  10uF, 10V, X5R, 20%  [CAPC1608N]
C27A  1.0uF, 25V, 20% X5R  [CAPC1608N]
C28A  10uF, 10V, X5R, 20%  [CAPC1608N]
C29A  1.0uF, 25V, 20% X5R  [CAPC1608N]
C30A  220uF, 10V, VS D  [ALCAP_D]
C31A  220uF, 10V, VS D  [ALCAP_D]
C32A  0.1uF, 6.3V, X5R  [CAPC0603N_B]
C33A  0.1uF, 6.3V, X5R  [CAPC0603N_B]
C34A  0.1uF, 25V, X5R  [CAPC1005N]
C35A  0.1uF, 6.3V, X5R  [CAPC0603N_B]
C36A  10uF, 10V, X5R, 20%  [CAPC1608N]
C37A  0.01uF, 10V, X5R, 10%  [CAPC0603N_B]
C38A  0.1uF, 6.3V, X5R  [CAPC0603N_B]
C39A  0.1uF, 6.3V, X5R  [CAPC0603N_B]
C40A  2200pF, X7R, 50V, 10%  [CAPC1005N]
C41A  2200pF, X7R, 50V, 10%  [CAPC1005N]
D10A  ESD5Z2.5T1  [SOD-523]
D11A  ESD5Z2.5T1  [SOD-523]
D12A  ESD5Z2.5T1  [SOD-523]
D13A  ESD5Z2.5T1  [SOD-523]
D14A  ESD5Z2.5T1  [SOD-523]
J12A  CUI SJ-43515TS-SMT  [CUI_SJ_43515TS-SMT]
L10A  BLM18KG121  value 3A 120 ohm  [INDC1608AN]
L11A  BLM18KG121  value 3A 120 ohm  [INDC1608AN]
L12A  BLM18KG121  value 3A 120 ohm (DNP)  [INDC1608AN]
L13A  BLM18KG121  value 3A 120 ohm  [INDC1608AN]
P10A  JST B2B-EH-A  [JST_B2B_EH_A]
P11A  JST B2B-EH-A  [JST_B2B_EH_A]
P12A  JST BM04B-SRSS-TB  [JST_BM04B_SRSS_TB]
Q10A  2N7002W  [SOT323-3AN]
Q11A  FDN304P  [SOT23-3N]
Q12A  2N7002W  [SOT323-3AN]
R10A  20k, 1%  [RESC1005N]
R10B  1k, 1%  [RESC1005N]
R11A  10k, 1%  [RESC1005N]
R11B  1k, 1%  [RESC1005N]
R12A  20k, 1%  [RESC1005N]
R13A  20k, 1%  [RESC1005N]
R14A  20k, 1%  [RESC1005N]
R15A  100k, 1%  [RESC1005N]
R16A  47k, 1%  [RESC1005N]
R17A  10k, 1%  [RESC1005N]
R18A  10k, 1%  [RESC1005N]
R19A  68k, 1%  [RESC1005N]
R20A  100k, 1%  [RESC1005N]
R21A  100, 1%  [RESC1005N]
R22A  2.2k, 1%  [RESC1005N]
R23A  1k, 1%  [RESC1005N]
R24A  0 ohm (DNP)  [RESC1005N]
R25A  0 ohm  [RESC1005N]
R26A  330, 1%  [RESC1005N]
R27A  330, 1%  [RESC1005N]
R28A  0 ohm (DNP)  [RESC1005N]
R29A  100, 1% (DNP)  [RESC1005N]
R31A  100, 1% (DNP)  [RESC1005N]
R32A  100, 1% (DNP)  [RESC1005N]
R34A  100, 1% (DNP)  [RESC1005N]
U10A  NSIWAY NS4890  [MSOP8]
U11A  Everest ES8328E  [QFN50P500X500-28V1N]
U12A  NSIWAY NS4890  [MSOP8]
U13A  MP34DT01  [STM_HCLGA_3MMx4MMx1MM]

### Blocks framed on the sheet
Digital microphone - PDM output: C33A P12A U13A
Power management switch for audio circuit: C32A Q10A Q11A Q12A R17A R19A R20A R21A

### Nets
AUD_P3.3V: C14A.2 C15A.2 C20A.2 C21A.2 C22A.2 C23A.1 C24A.2 C25A.2 Q11A.3(D) R11A.2 R15A.2 R21A.1 R25A.2 U11A.2(DVDD) U11A.3(PVDD) U11A.16(HPVDD) U11A.17(AVDD)
GND: C10A.1 C11A.2 C12A.1 C13A.2 C14A.1 C15A.1 C16A.1 C17A.2 C18A.1 C19A.1 C20A.1 C21A.1 C22A.1 C23A.2 C24A.1 C25A.1 C27A.1 C29A.1 C33A.1 C34A.1 C40A.1 C41A.1 D10A.2(A) D11A.2(A) D12A.2(A) D13A.2(A) D14A.2(A) L13A.1 P12A.4 Q10A.2(S) Q12A.2(S) R18A.2 R19A.2 R32A.1 R34A.1 U10A.7(GND) U11A.4(DGND) U11A.13(HPGND) U11A.18(AGND) U11A.29(PAD) U12A.7(GND) U13A.2(LR) U13A.5(GND)
P1.8V_VGEN3: R24A.2
P3.3V_DELAYED: C32A.2 C33A.2 P12A.1 Q11A.2(S) R10B.2 R11B.2 R20A.2 R29A.2 R31A.2 U13A.1(VDD)
P5.0V_DELAYED: C18A.2 C27A.2 U10A.6(VDD) U12A.6(VDD)
VANA: R28A.2
AUD_CLK: U11A.5(SCLK)
AUD_DIN: U11A.8(ASDOUT)
AUD_DOUT: U11A.6(DSDIN)
AUD_HP_IN: C34A.2 R16A.2
AUD_I2C3_SCL: C41A.2 R10B.1 R26A.1 U11A.28(CCLK)
AUD_I2C3_SDA: C40A.2 R11B.1 R27A.1 U11A.27(CDATA)
AUD_LRCLK: U11A.7(DLRCK) U11A.9(ALRCK)
AUD_MCLK: R29A.1 R32A.2 U11A.1(MCLK)
AUD_MIC_CLK: P12A.3 R31A.1 R34A.2 U13A.3(CLK)
AUD_MIC_DAT: P12A.2 U13A.4(DOUT)
AUD_PWRON: Q10A.1(G) R19A.1 U10A.1(~{SHDWN}) U12A.1(~{SHDWN})
AUD_VMID: C12A.2 C13A.1 U11A.20(VMID)
AUD_VREF: C16A.2 C17A.1 U11A.19(ADCVREF)
CN_L_SPK_LINE: C26A.2 R12A.2
CN_R_SPK_LINE: C28A.2 R14A.2
HP_IN: D12A.1(K) J12A.2(TN) R15A.1 R16A.1
HP_L_PRE: C31A.1 U11A.12(LOUT1)
HP_R_PRE: C30A.1 U11A.11(ROUT1)
HP_VGND_EMI: C35A.1 C36A.2 C37A.2 C39A.2 D10A.1(K) J12A.5(R) L12A.2 L13A.2
HPL_EMI: D13A.1(K) J12A.1(T) L11A.2 R18A.1
HPR_EMI: D11A.1(K) J12A.3(R) L10A.2
I2C3_SCL: R26A.2
I2C3_SDA: R27A.2
MIC_CABLE: C37A.1 C38A.2 D14A.1(K) J12A.4(S) R22A.1
MIC_DIFF_N: C39A.1 U11A.23(RIN1)
MIC_DIFF_P: C38A.1 U11A.24(LIN1)
SPK_L_N: P10A.1 U10A.8(VO2)
SPK_L_P: P10A.2 R10A.1 U10A.5(VO1)
SPK_R_N: P11A.1 U12A.8(VO2)
SPK_R_P: P11A.2 R13A.1 U12A.5(VO1)
NetC10A_2: C10A.2 C11A.1 U11A.25(DACREF)
NetC19A_2: C19A.2 U10A.2(BYP) U10A.3(+IN)
NetC26A_1: C26A.1 U11A.15(LOUT2)
NetC28A_1: C28A.1 U11A.14(ROUT2)
NetC29A_2: C29A.2 U12A.2(BYP) U12A.3(+IN)
NetC30A_2: C30A.2 L10A.1
NetC31A_2: C31A.2 L11A.1
NetC32A_1: C32A.1 Q11A.1(G) R17A.1 R20A.1
NetC35A_2: C35A.2 C36A.1 R22A.2 R23A.1
NetL12A_1: L12A.1 U11A.10(OUT3)
NetQ10A_3: Q10A.3(D) Q12A.1(G) R17A.2
NetQ12A_3: Q12A.3(D) R21A.2
NetR10A_2: R10A.2 R12A.1 U10A.4(-IN)
NetR11A_1: R11A.1 U11A.26(CE)
NetR13A_2: R13A.2 R14A.1 U12A.4(-IN)
NetR23A_2: R23A.2 R24A.1 R25A.1 R28A.1

Not connected (* = marked no-connect by the designer): U11A 21(RIN2)* 22(LIN2)*

### Layout directives
differential pair: MIC_DIFF_N, MIC_DIFF_P
net class AUD_CLK: AUD_MIC_CLK

### Notes on the sheet
- Microphone configured for pseudo-differential operation
- note: reprogram in BSP to 3.0V for micbias use, in case AUD_P3.3V is too noisy
- (near R10A) Also VANA option available
- Note: TS4990IST can be substituted for NS4890
- requires 2.4MHz clock + software filter to make PCM
- wired for left channel; connector for right-channel mic
- power down by stopping clock
- (near Q12A) active pulldown
- (near Q12A) to ensure audio codec reset
- Copyright 2012 Andrew "bunnie" Huang
- Copyrights: CC-BY-SA 3.0
- Patents: XL cross license
- Novena EVT1
- See http://bunniestudios.com/XL.html

### Library data of the parts
C10A C11A C12A C13A C14A C15A C16A C17A C18A C19A C20A C21A C22A C23A C24A C25A C26A C27A C28A C29A C32A C33A C34A C35A C36A C37A C38A C39A C40A C41A = Cap Semi: Capacitor (Semiconductor SIM Model); Published: 8-Jun-2000; LatestRevisionDate: 17-Jul-2002; LatestRevisionNote: Re-released for DXP Platform.; PackageReference: C1206; Publisher: Altium Limited
C30A C31A = Cap Pol3: Polarized Capacitor (Surface Mount); Published: 8-Jun-2000; LatestRevisionDate: 17-Jul-2002; LatestRevisionNote: Re-released for DXP Platform.; PackageReference: C0805; Publisher: Altium Limited
D10A D11A D12A D13A D14A = Tranzorb: On Semi 3.3V standoff TVS diode; Published: 24-Mar-1999; LatestRevisionDate: 17-Jul-2002; LatestRevisionNote: Re-released for DXP Platform.; PackageReference: DO-7; Publisher: Altium Limited
J12A = Phonejack4 TN: Jack Socket, 3.5mm, SMT, 4-conductor; PackageDocument: 2003; PCB_Layout: Complies with manufacturer's recommendation.; DrillAndSlotSize: Corresponds to nominal value.; Published: 15-Jul-2004; DatasheetDocument: 2003; PackageReference: S1VS_SSB; Publisher: Altium Limited; ComponentLink1Description: Manufacturer Link; ComponentLink1URL: http://www.cliffuk.co.uk/
L10A L11A L12A L13A = Inductor Iron: Magnetic-Core Inductor; Published: 24-Mar-1999; LatestRevisionDate: 17-Jul-2002; LatestRevisionNote: Re-released for DXP Platform.; PackageReference: AXIAL-0.9; Publisher: Altium Limited
P10A P11A = Header 2: Header, 2-Pin; LatestRevisionDate: 17-Jul-2002; LatestRevisionNote: Re-released for DXP Platform.; Publisher: Altium Limited
P12A = Header 4H: Header, 4-Pin, Right Angle; LatestRevisionDate: 17-Jul-2002; LatestRevisionNote: Re-released for DXP Platform.; Publisher: Altium Limited
Q10A Q12A = MOSFET-N: N-Channel MOSFET; Published: 8-Jun-2000; LatestRevisionDate: 17-Jul-2002; LatestRevisionNote: Re-released for DXP Platform.; PackageVersion: 1995/1996; PackageReference: E3; Publisher: Altium Limited
Q11A = MOSFET-P: P-Channel MOSFET; Published: 8-Jun-2000; LatestRevisionDate: 17-Jul-2002; LatestRevisionNote: Re-released for DXP Platform.; PackageVersion: 1995/1996; PackageReference: E3; Publisher: Altium Limited; PackageDescription: TO, Flat Index; 3 In-Line, Axial Leads; Body Dia. 4.6mm; Lead Dia. 0.5 mm (max)
R10A R10B R11A R11B R12A R13A R14A R16A R17A R18A R19A R21A R22A R23A R24A R25A R26A R27A R28A R29A R31A R32A R34A = Res1: Resistor; Value: 100k; Published: 8-Jun-2000; LatestRevisionDate: 17-Jul-2002; LatestRevisionNote: Re-released for DXP Platform.; PackageReference: AXIAL-0.3; Publisher: Altium Limited
R15A R20A = Res1: Resistor; Published: 8-Jun-2000; LatestRevisionDate: 17-Jul-2002; LatestRevisionNote: Re-released for DXP Platform.; PackageReference: AXIAL-0.3; Publisher: Altium Limited; Value: 100k
U10A U12A = NSIWAY_NS4890: 1W 8 ohm low-cost amplifier
U11A = Everest_ES8328: Low-cost audio CODEC by Everest
U13A = MP34DT01: ST Micro silicon microphone, PDM digital output